# EAGLE design ESP32-Function (EAGLE 9.5.1)
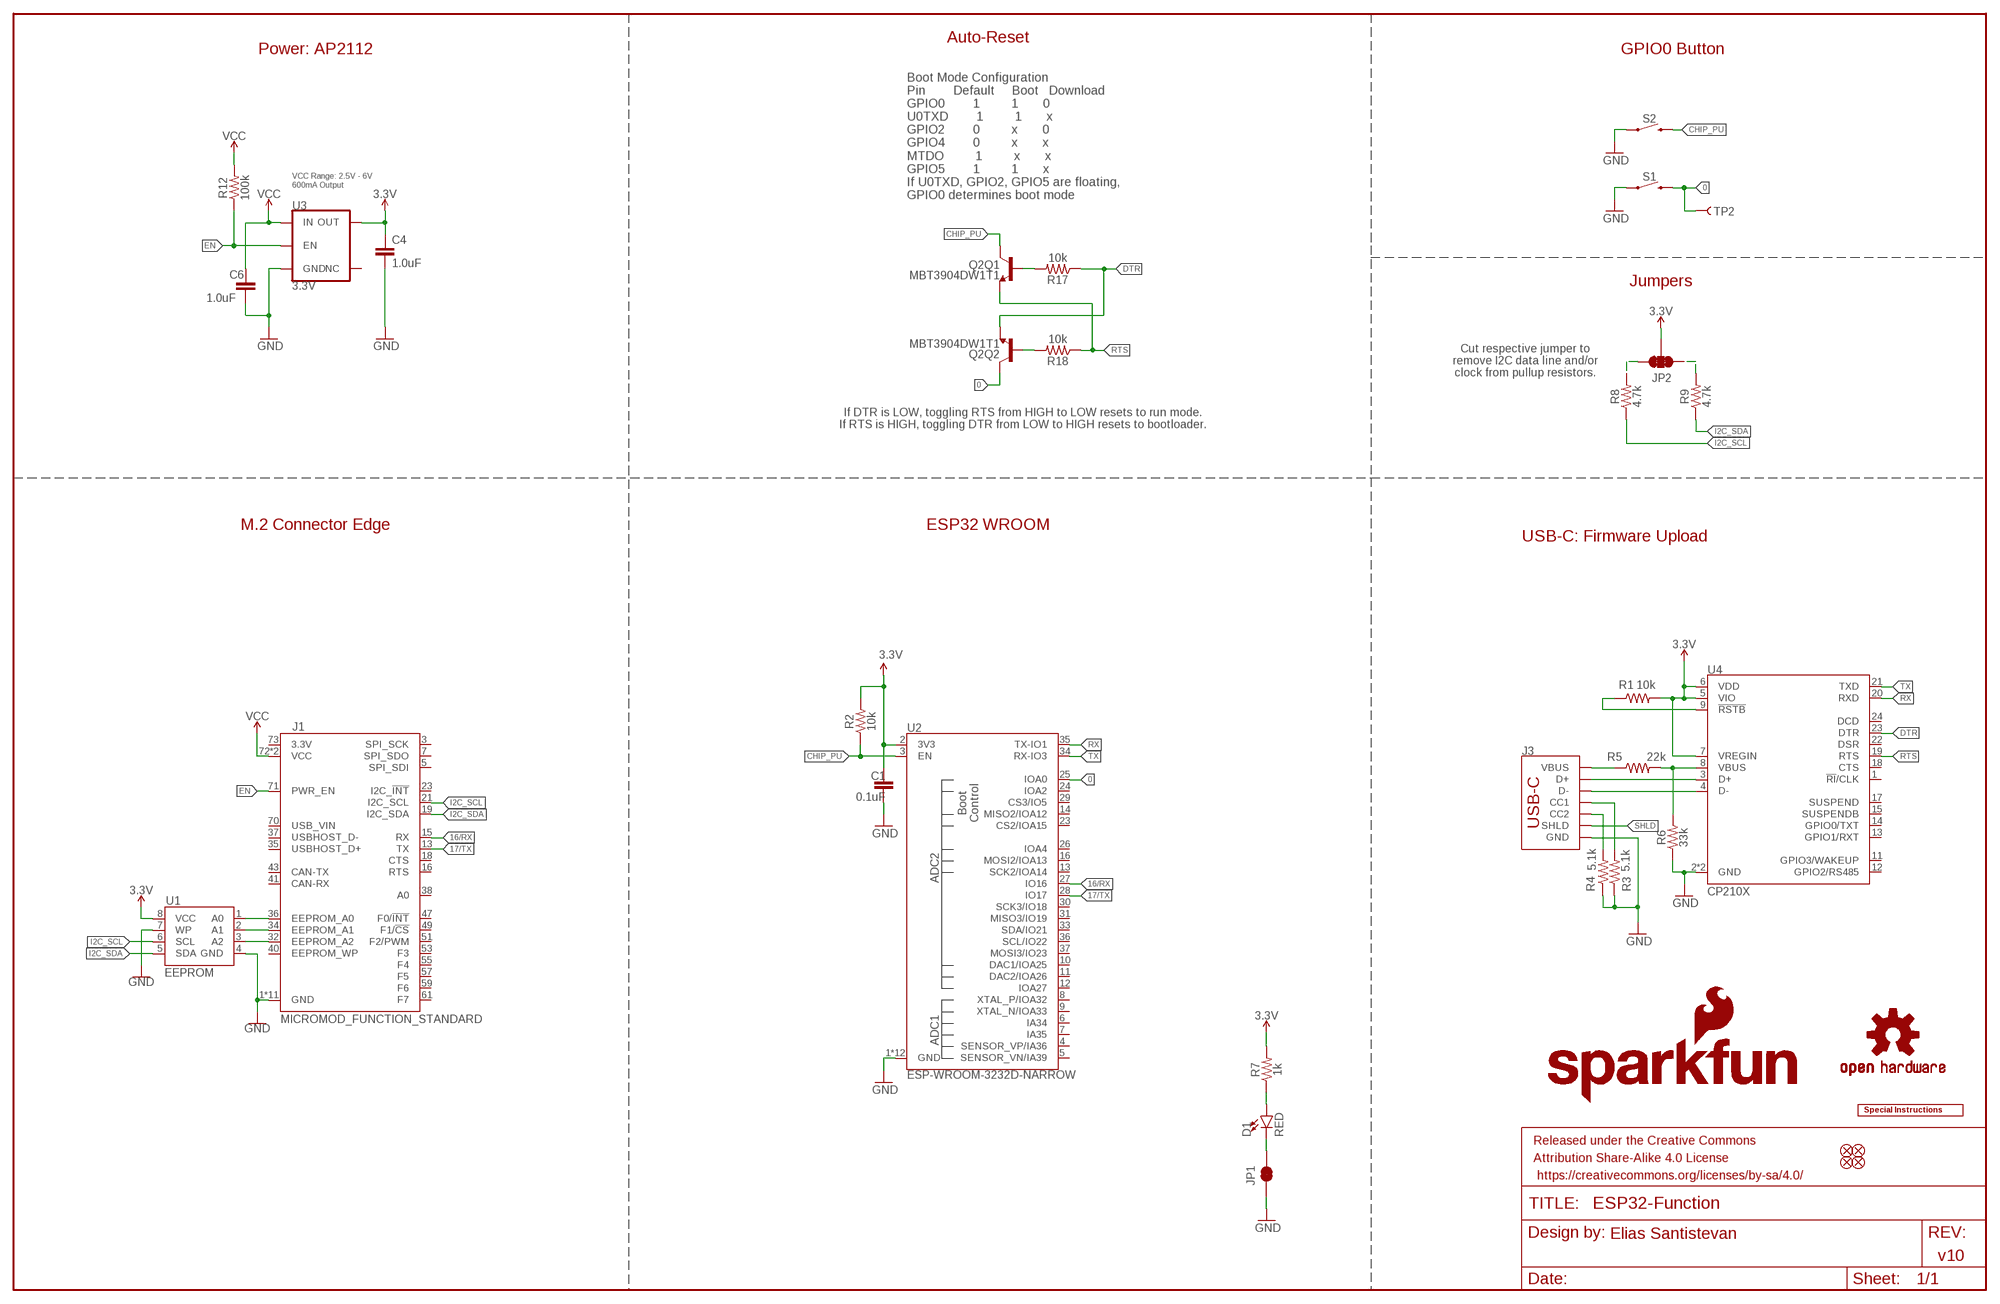
[diagram p0: schematic, sheet 1]

## Parts
C1  0.1uF  0.1UF-0603-25V-(+80/-20%)  [0603]
C4  1.0uF  1.0UF-0603-16V-10%  [0603]
C6  1.0uF  1.0UF-0603-16V-10%  [0603]
D1  RED  LED-RED0603  [LED-0603]
FD1  FIDUCIAL1X2  [FIDUCIAL-1X2]
FD2  FIDUCIAL1X2  [FIDUCIAL-1X2]
FD3  FIDUCIAL1X2  [FIDUCIAL-1X2]
FD4  FIDUCIAL1X2  [FIDUCIAL-1X2]
FRAME2  FRAME-LEDGER  [CREATIVE_COMMONS]
J1  MICROMOD_FUNCTION_STANDARD  [M.2-CARD-E-22_FUNCTION_STANDARD]
J3  USB_C_2-LAYER_PADS  [USB-C-16P-2LAYER-PADS]
JP1  JUMPER-SMT_2_NC_TRACE_SILK  [SMT-JUMPER_2_NC_TRACE_SILK]
JP2  JUMPER-SMT_3_2-NC_TRACE_SILK  [SMT-JUMPER_3_2-NC_TRACE_SILK]
LOGO1  SPECIAL_INSTRUCTIONS-ORDERING  [ORDERING_INSTRUCTIONS]
LOGO2  SFE_LOGO_NAME_FLAME.2_INCH  [SFE_LOGO_NAME_FLAME_.2]
LOGO3  OSHW-LOGOS  [OSHW-LOGO-S]
Q2  MBT3904DW1T1  TRANS_NPN_DUAL-MBT3904DW1T1  [SC70-6]
R1  10k  10KOHM-0603-1/10W-1%  [0603]
R2  10k  10KOHM-0603-1/10W-1%  [0603]
R3  5.1k  5.1KOHM5.1KOHM-0603-1/10W-1%  [0603]
R4  5.1k  5.1KOHM5.1KOHM-0603-1/10W-1%  [0603]
R5  22k  22KOHM-0603-1/10W-1%  [0603]
R6  33k  33KOHM-0603-1/10W-1%  [0603]
R7  1k  1KOHM-0603-1/10W-1%  [0603]
R8  4.7k  4.7KOHM-0603-1/10W-1%  [0603]
R9  4.7k  4.7KOHM-0603-1/10W-1%  [0603]
R12  100k  100KOHM-0603-1/10W-1%  [0603]
R17  10k  10KOHM-0603-1/10W-1%  [0603]
R18  10k  10KOHM-0603-1/10W-1%  [0603]
S1  MOMENTARY-SWITCH-SPST-SMD-5.2MM-TALL  [TACTILE_SWITCH_SMD_5.2MM]
S2  MOMENTARY-SWITCH-SPST-SMD-5.2MM-TALL  [TACTILE_SWITCH_SMD_5.2MM]
TP2  TEST-POINTTP_15TH_THRU  [TP_15TH]
U1  EEPROM  EEPROM-I2C512K  [SO08]
U2  ESP-WROOM-3232D-NARROW  [ESP-WROOM-32D-NARROW]
U3  3.3V  V_REG_AP2112K-3.3V  [SOT23-5]
U4  CP210X  CP2102N  [QFN24]

## Nets
0: Q2.6(Q2:C) S1.3 TP2.1 U2.25(IOA0)
3.3V: C1.1 C4.1 JP2.2 R1.2 R2.2 R7.2 U1.8(VCC) U2.2(3V3) U3.5(OUT) U4.5(VIO) U4.6(VDD) U4.7(VREGIN)
16/RX: J1.15(RX) U2.27(IO16)
17/TX: J1.13(TX) U2.28(IO17)
CHIP_PU: Q2.3(Q1:C) R2.1 S2.3 U2.3(EN)
D+: J3.A6(D+) J3.B6(D+) U4.3(D+)
D-: J3.A7(D-) J3.B7(D-) U4.4(D-)
DTR: Q2.1(Q2:E) R17.1 U4.23(DTR)
EN: J1.71(PWR_EN) R12.1 U3.3(EN)
GND: C1.2 C4.2 C6.2 J1.1(GND) J1.33(GND) J1.39(GND) J1.45(GND) J1.75(GND) J1.GND1(GND) J1.GND2(GND) J1.GND3(GND) J1.GND4(GND) J1.GND5(GND) J1.GND6(GND) J3.GND J3.GND2(GND) JP1.1 R3.1 R4.1 R6.1 S1.1 S2.1 U1.4(GND) U1.7(WP) U2.1(GND) U2.15(GND) U2.38(GND) U2.GND1(GND) U2.GNDT1(GND) U2.GNDT2(GND) U2.GNDT3(GND) U2.GNDT4(GND) U2.GNDT5(GND) U2.GNDT6(GND) U2.GNDT7(GND) U2.GNDT8(GND) U3.2(GND) U4.2(GND) U4.PAD(GND)
I2C_SCL: J1.21(I2C_SCL) R8.1 U1.6(SCL)
I2C_SDA: J1.19(I2C_SDA) R9.1 U1.5(SDA)
N$1: R1.1 U4.9(!RSTB)
N$2: J3.A5(CC1) R3.2
N$3: J3.VBUS1(VBUS) J3.VBUS2(VBUS) R5.1
N$4: R5.2 R6.2 U4.8(VBUS)
N$5: J3.B5(CC2) R4.2
N$6: D1.C JP1.2
N$7: D1.A R7.1
N$8: J1.32(EEPROM_A2) U1.3(A2)
N$9: J1.34(EEPROM_A1) U1.2(A1)
N$10: Q2.5(Q1:B) R17.2
N$11: J1.36(EEPROM_A0) U1.1(A0)
N$12: Q2.2(Q2:B) R18.2
N$13: JP2.1 R9.2
N$14: JP2.3 R8.2
RTS: Q2.4(Q1:E) R18.1 U4.19(RTS)
RX: U2.35(TX-IO1) U4.20(RXD)
SHLD: J3.SHLD1(SHLD) J3.SHLD2(SHLD) J3.SHLD3(SHLD) J3.SHLD4(SHLD)
TX: U2.34(RX-IO3) U4.21(TXD)
VCC: C6.1 J1.72(VCC) J1.74(VCC) R12.2 U3.1(IN)
Unconnected: J1.3(SPI_SCK) J1.5(SPI_SDI) J1.7(SPI_SDO) J1.16(RTS) J1.18(CTS) J1.23(I2C_!INT!) J1.35(USBHOST_D+) J1.37(USBHOST_D-) J1.38(A0) J1.40(EEPROM_WP) J1.41(CAN-RX) J1.43(CAN-TX) J1.47(F0/!INT!) J1.49(F1/!CS!) J1.51(F2/PWM) J1.53(F3) J1.55(F4) J1.57(F5) J1.59(F6) J1.61(F7) J1.70(USB_VIN) J1.73(3.3V) U2.4(SENSOR_VP/IA36) U2.5(SENSOR_VN/IA39) U2.6(IA34) U2.7(IA35) U2.8(XTAL_P/IOA32) U2.9(XTAL_N/IOA33) U2.10(DAC1/IOA25) U2.11(DAC2/IOA26) U2.12(IOA27) U2.13(SCK2/IOA14) U2.14(MISO2/IOA12) U2.16(MOSI2/IOA13) U2.23(CS2/IOA15) U2.24(IOA2) U2.26(IOA4) U2.29(CS3/IO5) U2.30(SCK3/IO18) U2.31(MISO3/IO19) U2.33(SDA/IO21) U2.36(SCL/IO22) U2.37(MOSI3/IO23) U3.4(NC) U4.1(!RI!/CLK) U4.11(GPIO3/WAKEUP) U4.12(GPIO2/RS485) U4.13(GPIO1/RXT) U4.14(GPIO0/TXT) U4.15(SUSPENDB) U4.17(SUSPEND) U4.18(CTS) U4.22(DSR) U4.24(DCD)

## Notes on the sheet
- Auto-Reset
- Power: AP2112 | GPIO0 Button
- VCC Range: 2.5V - 6V 
  600mA Output
- Boot Mode Configuration
  Pin        Default     Boot   Download
  GPIO0        1         1       0
  U0TXD        1         1       x
  GPIO2        0         x       0
  GPIO4        0         x       x
  MTDO         1         x       x
  GPIO5        1         1       x
  If U0TXD, GPIO2, GPIO5 are floating, 
  GPIO0 determines boot mode
- Jumpers
- Cut respective jumper to
  remove I2C data line and/or
  clock from pullup resistors.
- If DTR is LOW, toggling RTS from HIGH to LOW resets to run mode.
  If RTS is HIGH, toggling DTR from LOW to HIGH resets to bootloader.
- M.2 Connector Edge | ESP32 WROOM
- USB-C: Firmware Upload
- Elias Santistevan
- v10

## Library data of the parts
C1 = SparkFun-Capacitors:0.1UF: 0.1µF ceramic capacitors A capacitor is a passive two-terminal electrical component used to store electrical energy temporarily in an electric field.; PROD_ID: CAP-00810
C4 C6 = SparkFun-Capacitors:1.0UF: 1µF ceramic capacitors A capacitor is a passive two-terminal electrical component used to store electrical energy temporarily in an electric field.; PROD_ID: CAP-00868
D1 = SparkFun-LED:LED-RED: Red SMD LED Used in manufacturing of most products at SparkFun Packages: 0603 - SMD 0603 package [Product Link] <http://docs.avagotech.com/docs/AV02-0551EN> 0603 SMART - SMD 0603 SMART package ( more efficient and expensive)[Product Link] <http://www.osram-os.com/Graphics/XPic2/00077099_0.pdf> 1206 - SMD1206 package [Product Link] <https://www.sparkfun.com/datasheets/DevTools/LilyPad/Q150OVS4.pdff> SparkFun Products: Pro Mini 328 -5V <https://www.sparkfun.com/products/821> RedBoard <https://www.sparkfun.com/products/12757> IOIO-OTG <https://www.sparkfun.com/products/13613>; PROD_ID: DIO-00819
FD1-FD4 = SparkFun-Aesthetics:FIDUCIAL: Fiducial Alignment Points Point-of-reference for pick-and-place machines and other optical instruments.
FRAME2 = SparkFun-Aesthetics:FRAME-LEDGER: Schematic Frame - Ledger Standard 11x14 US Ledger frame
J1 = SparkFun-MicroMod:MICROMOD_FUNCTION: MicroMod Connector Description: A card edge connector and mating PCB connector to allow various MicroMod Processor Boards to be coupled with various carrier boards of different capabilities. Based on the M.2 standard.
J3 = SparkFun-Connectors:USB_C: USB Type C 16Pin Connector Super Speed pins not available on the 16-pin purely SMD connector so this part is best for USB 2.0 implementations. D1 and D2 are tied together enabling D+/- no matter which way the cable is plugged into the connector. The two channel configuration pins (CC1/2) are exposed. These are normally connected to ground via 5.1k resistors but can be reconfigured for high current/high power applications. **4-LAYER BOARD WARNING!!** If designing 4-layer board, make sure to select the variant _4-LAYER-ISOLATED. The linked footprint (USB-C-16-4LAYER-ISOLATED) includes some very necessary cutout polygons in the inner layers (2 and 15). This prevents the PTH mounting shield legs on the USB connector from electrically connecting any other polygons on the inner layers (usually VCC and GND).; PROD_ID: CONN-14122
JP1 = SparkFun-Jumpers:JUMPER-SMT_2_NC_TRACE: Normally closed trace jumper This jumper has a trace between two pads so it's normally closed (NC). Use a razor knife to open the connection. For best results follow the IPC guidelines for cutting traces: Cutout at least 0.063 mm (0.005 in). Remove all loose material to clean up the cut area. Seal the cut with an approved epoxy. Reapply solder to reclose the connection.
JP2 = SparkFun-Jumpers:JUMPER-SMT_3_2-NC_TRACE: Normally closed trace jumper (2 of 2 connections) This jumper has a trace between all three pads so they are normally closed (NC). Use a razor knife to open the connection(s). For best results follow the IPC guidelines for cutting traces: Cutout at least 0.063 mm (0.005 in). Remove all loose material to clean up the cut area. Seal the cut with an approved epoxy. Reapply solder to reclose the connection(s).
LOGO1 = SparkFun-Aesthetics:SPECIAL_INSTRUCTIONS: Special Ordering/Production Instructions Alert Symbol for special PCB ordering instructions or unique production process warnings. Ordering Instructions Production Instructions Types of information that should be added to box: Copper weight Soldermask color Silk color PCB thickness Number of layers PCB Standard: 1.6mm FR4 1 oz copper immersion silver plating red soldermask white silkscreen Types of information that should be added to box: Special wash requirements Depaneling instructions Humidification Glue curing Default text settings: 0.07 inch 9% ratio 50% line distance
LOGO2 = SparkFun-Aesthetics:SFE_LOGO_NAME_FLAME: SparkFun Font Logo w/ Flame This is the SparkFun full logo. The logo on the schematic will always be the same size; the package variant is the height of the flame part of the logo. Default layer for the logo on the board is tSilk.
LOGO3 = SparkFun-Aesthetics:OSHW-LOGO: Open-Source Hardware (OSHW) Logo This logo indicates the piece of hardware it is found on incorporates a OSHW license and/or adheres to the definition of open source hardware found here: http://freedomdefined.org/OSHW
Q2 = SparkFun-DiscreteSemi:TRANS_NPN_DUAL: Dual NPN Transistors in Single Package The MBT3904W1 puts two general purpose 3904 NPN transistors in a single package. Datasheet <http://www.onsemi.com/pub_link/Collateral/MBT3904DW1T1-D.PDF> SparkFun Products: SparkFun ESP32 Thing <https://www.sparkfun.com/products/13907>; PROD_ID: TRANS-13337
R1 R2 R17 R18 = SparkFun-Resistors:10KOHM: 10kΩ resistor A resistor is a passive two-terminal electrical component that implements electrical resistance as a circuit element. Resistors act to reduce current flow, and, at the same time, act to lower voltage levels within circuits. - Wikipedia; PROD_ID: RES-00824
R3 R4 = SparkFun-Resistors:5.1KOHM; PROD_ID: RES-12083
R5 = SparkFun-Resistors:22KOHM: 22kΩ resistor A resistor is a passive two-terminal electrical component that implements electrical resistance as a circuit element. Resistors act to reduce current flow, and, at the same time, act to lower voltage levels within circuits. - Wikipedia; PROD_ID: RES-07853
R6 = SparkFun-Resistors:33KOHM: 33kΩ resistor A resistor is a passive two-terminal electrical component that implements electrical resistance as a circuit element. Resistors act to reduce current flow, and, at the same time, act to lower voltage levels within circuits. - Wikipedia; PROD_ID: RES-08416
R7 = SparkFun-Resistors:1KOHM: 1kΩ resistor A resistor is a passive two-terminal electrical component that implements electrical resistance as a circuit element. Resistors act to reduce current flow, and, at the same time, act to lower voltage levels within circuits. - Wikipedia; PROD_ID: RES-07856
R8 R9 = SparkFun-Resistors:4.7KOHM: 4.7kΩ resistor A resistor is a passive two-terminal electrical component that implements electrical resistance as a circuit element. Resistors act to reduce current flow, and, at the same time, act to lower voltage levels within circuits. - Wikipedia; PROD_ID: RES-07857
R12 = SparkFun-Resistors:100KOHM: 100kΩ resistor A resistor is a passive two-terminal electrical component that implements electrical resistance as a circuit element. Resistors act to reduce current flow, and, at the same time, act to lower voltage levels within circuits. - Wikipedia; PROD_ID: RES-07828
S1 S2 = SparkFun-Switches:MOMENTARY-SWITCH-SPST: Momentary Switch (Pushbutton) - SPST Normally-open (NO) SPST momentary switches (buttons, pushbuttons). Variants PTH-12MM - 12mm square, through-hole Momentary Pushbutton Switch - 12mm Square <https://www.sparkfun.com/products/9190> (COM-09190) PTH-6.0MM, PTH-6.0MM-KIT - 6.0mm square, through-hole Mini Pushbutton Switch <https://www.sparkfun.com/products/97> (COM-00097) KIT package intended for soldering kit's - only one side of pads' copper is exposed. PTH-RIGHT-ANGLE-KIT - Right-angle, through-hole Right Angle Tactile Button <https://www.sparkfun.com/products/10791> - Used on SparkFun BigTime Watch Kit <https://www.sparkfun.com/products/11734> SMD-12MM - 12mm square, surface-mount Tactile Button - SMD (12mm) <https://www.sparkfun.com/products/12993> (COM-12993) Used on SparkFun PicoBoard <https://www.sparkfun.com/products/11888> SMD-4.5MM - 4.5mm Square Trackball Switch Used on SparkFun Blackberry Trackballer Breakout <https://www.sparkfun.com/products/13169> SMD-4.6MMX2.8MM - 4.60mm x 2.80mm, surface mount Used on SparkFun Pro Micro - RP2040 <https://www.sparkfun.com/products/17717> SMD-5.2MM, SMD-5.2-REDUNDANT - 5.2mm square, surface-mount Mini Pushbutton Switch - SMD <https://www.sparkfun.com/products/8720> (COM-08720) Used on Arduino Pro Mini <https://www.sparkfun.com/products/11114> REDUNDANT package connects both switch circuits together SMD-6.0X3.5MM - 6.0 x 3.5mm, surface mount Momentary Reset Switch SMD <https://www.sparkfun.com/products/8229> (COM-08229) SMD-6.2MM-TALL - 6.2mm square, surface mount Tactile Button - SMD (6mm) <https://www.sparkfun.com/products/12992> Used on SparkFun Digital Sandbox <https://www.sparkfun.com/products/12651> SMD-RIGHT-ANGLE - Right-angle, surface mount Used on SparkFun Block for Intel® Edison - Arduino <https://www.sparkfun.com/products/13036>; PROD_ID: SWCH-14139
TP2 = SparkFun-Connectors:TEST-POINT: SparkFun Test Points Bare copper test points for troubleshooting or In-Circuit-Testing. These are used by our Production team for verifying production board runs using pogo-pins on test beds. SparkFun Products: SparkFun LSM9DS1 Breakout <https://www.sparkfun.com/products/13284> SparkFun PSOC <https://www.sparkfun.com/products/13714> SparkFun Load Cell Amplifier <https://www.sparkfun.com/products/13879>
U1 = SparkFun-IC-Memory:EEPROM-I2C: I2C EEPROMs, 24LC256 and others 24LC256 Series 256 kb I2C 2 Wire (32 k x 8 Bit) 2.5 V Serial EEPROM SMD - SOIC-8 Datasheet SparkFun Products SparkFun UDB5 - PIC UAV Development Board <https://www.sparkfun.com/products/11703> (GPS-11703); PROD_ID: IC-14645
U2 = SparkFun-RF:ESP-WROOM-32: ESP-WROOM-32D - trace antenna (includes keepout) ESP-WROOM-32U - U.FL antenna connector Includes both "standard" footprints and "narrow" version (for use with tighter layouts).; PROD_ID: IC-15676
U3 = SparkFun-IC-Power:V_REG_AP2112: AP2112 - 600mA CMOS LDO Regulator w/ Enable The AP2112 is CMOS process low dropout linear regulator with enable function, the regulator delivers a guaranteed 600mA (min.) continuous load current. Features Output Voltage Accuracy: ±1.5% Output Current: 600mA (Min.) Foldback Short Current Protection: 50mA Enable Function to Turn ON/OFF VOUT Low Dropout Voltage (3.3V): 250mV (Typ.) @IOUT=600mA Excellent Load Regulation: 0.2%/A (Typ.) Excellent Line Regulation: 0.02%/V (Typ.) Low Quiescent Current: 55μA (Typ.) Low Standby Current: 0.01μA (Typ.) Low Output Noise: 50μVRMS PSRR: 100Hz -65dB, 1kHz -65dB OTSD Protection Stable with 1.0μF Flexible Cap: Ceramic, Tantalum and Aluminum Electrolytic Operation Temperature Range: -40°C to 85°C ESD: MM 400V, HBM 4000V; PROD_ID: VREG-12457
U4 = SparkFun-IC-Comms:CP2102N; PROD_ID: IC-14020

## Net classes
1 Antenna: width 1 mm, clearance 0.3 mm
2 3.3V: width 0.203 mm

## Board
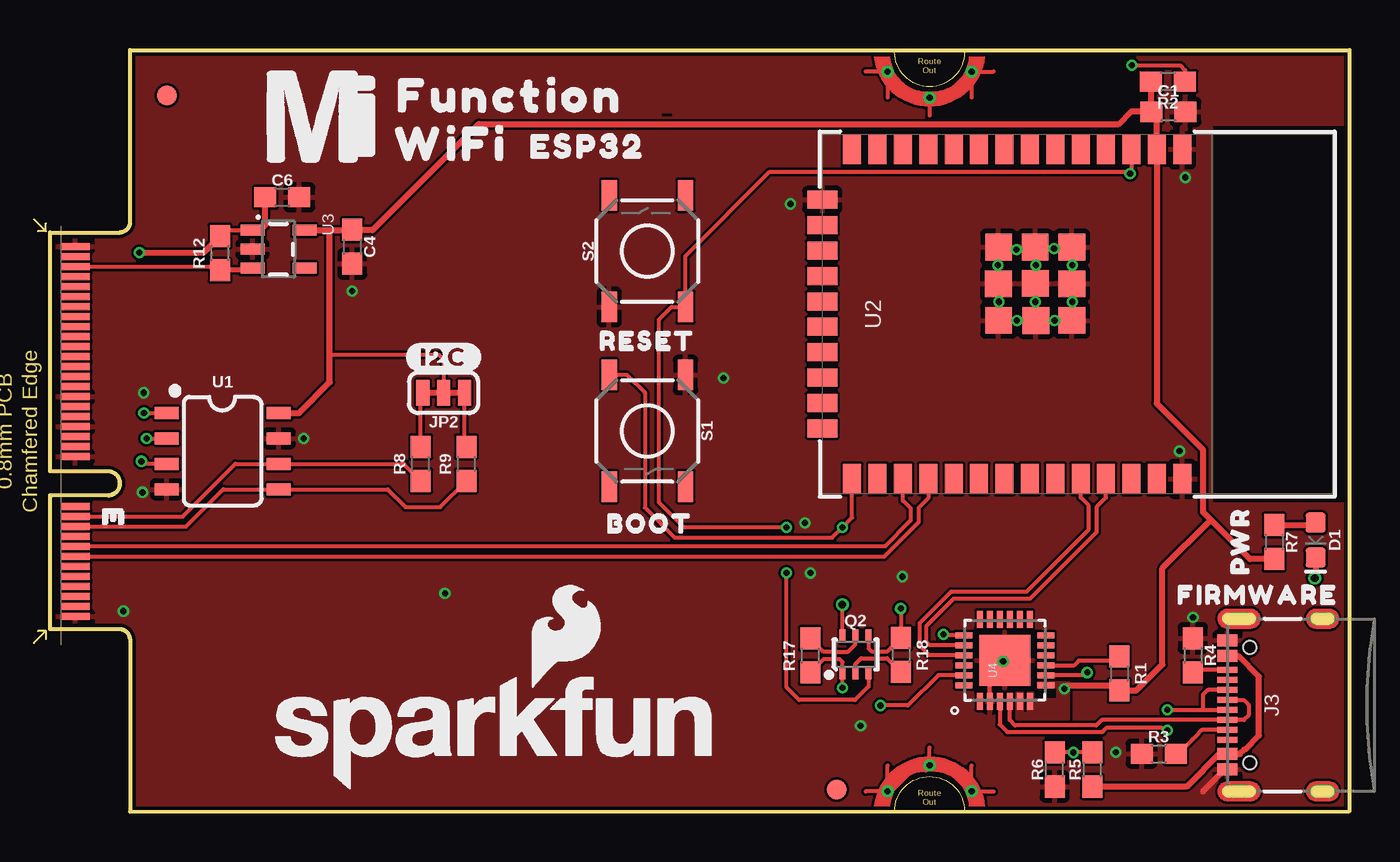
[diagram p1: board, top side]
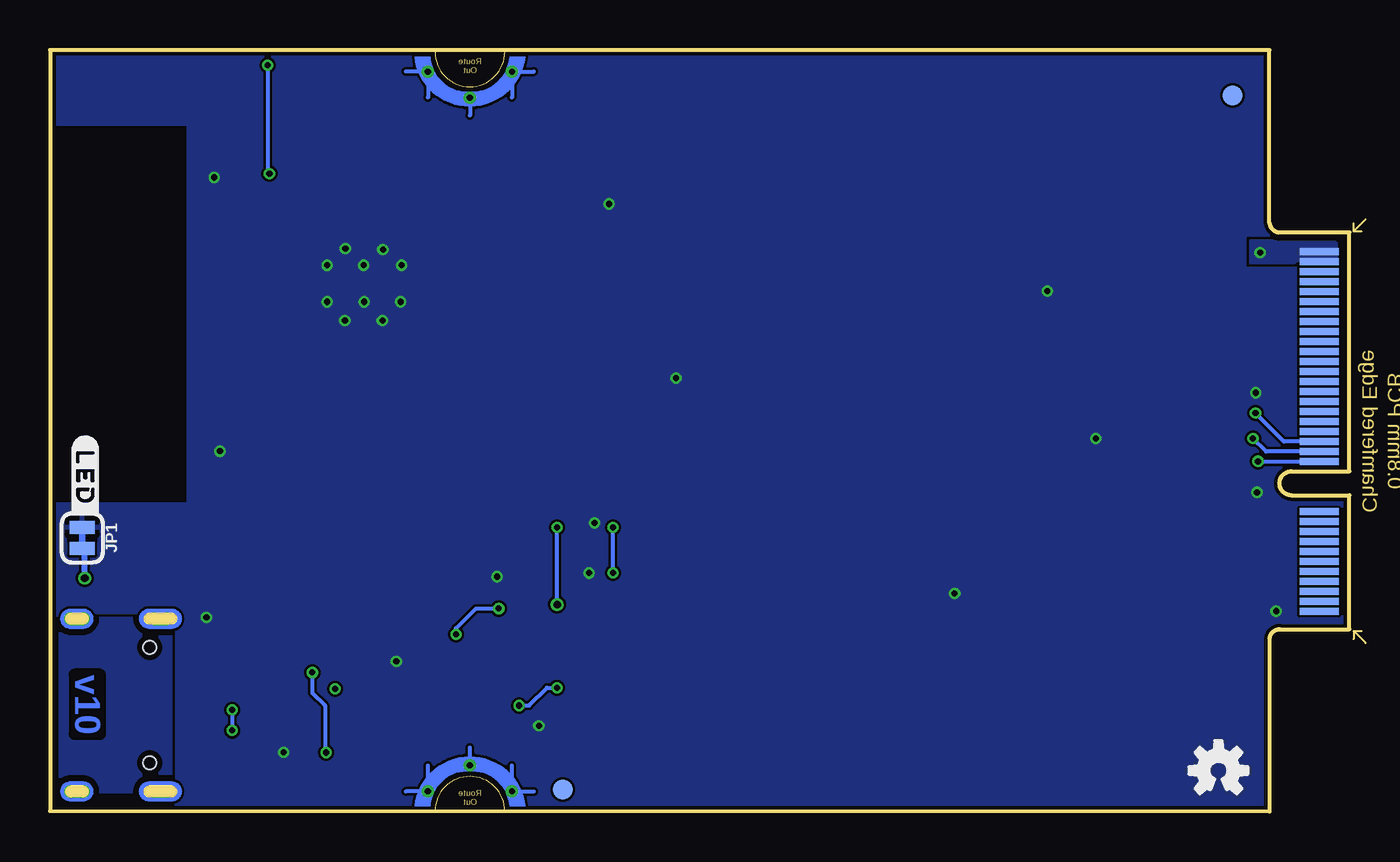
[diagram p2: board, bottom side, seen from below]

Size 64.99 x 38.1 mm. Coordinates in mm from the lower left corner, seen from the top.
Outline: 0,9.12 0,15.82 2.9,15.82 arc180 2.9,17.02 0,17.02 0,28.98 3.5,28.98 arc84 4,29.45 4,38.1 64.98,38.1 64.98,0.03 4,0 4,8.65 arc85 3.5,9.12 0,9.12
Copper layers (1*16): Top 0.035mm / dielectric 1.5mm / Bottom 0.035mm
Design rules "SparkFun-2-Layer-Minimum-JLCPCB": minimum track width 5mil, minimum drill 0.3mm, track to track 5mil, track to pad 5mil, pad to pad 5mil, via to via 5mil, smd to smd 5mil, copper to edge 7mil, drill to drill 7mil, minimum pad ring 5mil, minimum via ring 5mil, stop-mask expansion 2.5mil, vias tented up to drill 25mil, thermal gap 10mil
tRestrict: area 30.6,34.8 to 31.1,34.9; area 58.2,15.5 to 64.8,34.3
bRestrict: area 58.2,15.5 to 64.8,34.3

### Footprints (pad centres in the part's own frame; a part is rotated, then mirrored left to right if it is on the bottom)
0603 = smd 1.1 x 1: 1 -0.85,0; 2 0.85,0
LED-0603 = smd 1 x 1: A -0.877,0; C 0.877,0
FIDUCIAL-1X2 = smd 1 x 1: 1 0,0
M.2-CARD-E-22_FUNCTION_STANDARD = smd 0.35 x 1.45: 1 9.25,1.275; 3 8.75,1.275; 5 8.25,1.275; 7 7.75,1.275; 9 7.25,1.275; 11 6.75,1.275; 13 6.25,1.275; 15 5.75,1.275; 17 5.25,1.275; 19 4.75,1.275; 21 4.25,1.275; 23 3.75,1.275; 33 1.25,1.275; 35 0.75,1.275; 37 0.25,1.275; 39 -0.25,1.275; 41 -0.75,1.275; 43 -1.25,1.275; 45 -1.75,1.275; 47 -2.25,1.275; 49 -2.75,1.275; 51 -3.25,1.275; 53 -3.75,1.275; 55 -4.25,1.275; 57 -4.75,1.275; 59 -5.25,1.275; 61 -5.75,1.275; 63 -6.25,1.275; 65 -6.75,1.275; 67 -7.25,1.275; 69 -7.75,1.275; 71 -8.25,1.275; 73 -8.75,1.275; 75 -9.25,1.275 | smd 0.35 x 1.95 bottom: 2 9,1.525; 4 8.5,1.525; 6 8,1.525; 8 7.5,1.525; 10 7,1.525; 12 6.5,1.525; 14 6,1.525; 16 5.5,1.525; 18 5,1.525; 20 4.5,1.525; 22 4,1.525; 32 1.5,1.525; 34 1,1.525; 36 0.5,1.525; 38 0,1.525; 40 -0.5,1.525; 42 -1,1.525; 44 -1.5,1.525; 46 -2,1.525; 48 -2.5,1.525; 50 -3,1.525; 52 -3.5,1.525; 54 -4,1.525; 56 -4.5,1.525; 58 -5,1.525; 60 -5.5,1.525; 62 -6,1.525; 64 -6.5,1.525; 66 -7,1.525; 68 -7.5,1.525; 70 -8,1.525; 72 -8.5,1.525; 74 -9,1.525 | drill 0.305 pad 0.61: GND1 -18,41.9; GND2 -16.7,44; GND3 -18,46.1; GND4 18,41.9; GND5 16.7,44; GND6 18,46.1
USB-C-16P-2LAYER-PADS = smd 0.3 x 1: A5 -1.25,-0.34; A6 -0.25,-0.34; A7 0.25,-0.34; A8 1.25,-0.34; B5 1.75,-0.34; B6 0.75,-0.34; B7 -0.75,-0.34; B8 -1.75,-0.34 | smd 0.6 x 1: GND -3.225,-0.34; GND2 3.225,-0.34; VBUS1 -2.45,-0.34; VBUS2 2.45,-0.34 | drill 0.4 pad 0.6 long: SHLD1 -4.318,-0.915; SHLD2 4.318,-0.915; SHLD3 -4.318,-5.095; SHLD4 4.318,-5.095 | hole 0.65: -2.89,-1.445; 2.89,-1.445
SMT-JUMPER_2_NC_TRACE_SILK = smd 0.66 x 1.27: 1 -0.521,0; 2 0.521,0
SMT-JUMPER_3_2-NC_TRACE_SILK = smd 0.66 x 1.27: 1 -1.041,0; 2 0,0; 3 1.041,0
SC70-6 = smd 0.3 x 0.66: 1 -0.65,-0.92; 2 0,-0.92; 3 0.65,-0.92; 4 0.65,0.92; 5 0,0.92; 6 -0.65,0.92
TACTILE_SWITCH_SMD_5.2MM = smd 1.524 x 0.762: 1 -2.794,1.905; 2 2.794,1.905; 3 -2.794,-1.905; 4 2.794,-1.905
TP_15TH = drill 0.381 pad 0.61: 1 0,0
SO08 = smd 0.6 x 1.2: 1 -1.905,-2.8; 2 -0.635,-2.8; 3 0.635,-2.8; 4 1.905,-2.8; 5 1.905,2.8; 6 0.635,2.8; 7 -0.635,2.8; 8 -1.905,2.8
ESP-WROOM-32D-NARROW = smd 0.9 x 1.5: 1 6.43,8.238; 2 5.16,8.238; 3 3.89,8.238; 4 2.62,8.238; 5 1.35,8.238; 6 0.08,8.238; 7 -1.19,8.238; 8 -2.46,8.238; 9 -3.73,8.238; 10 -5,8.238; 11 -6.27,8.238; 12 -7.54,8.238; 13 -8.81,8.238; 14 -10.08,8.238; 25 -10.08,-8.238; 26 -8.81,-8.238; 27 -7.54,-8.238; 28 -6.27,-8.238; 29 -5,-8.238; 30 -3.73,-8.238; 31 -2.46,-8.238; 32 -1.19,-8.238; 33 0.08,-8.238; 34 1.35,-8.238; 35 2.62,-8.238; 36 3.89,-8.238; 37 5.16,-8.238; 38 6.43,-8.238 | smd 1.5 x 0.9: 15 -11.57,5.715; 16 -11.57,4.445; 17 -11.57,3.175; 18 -11.57,1.905; 19 -11.57,0.635; 20 -11.57,-0.635; 21 -11.57,-1.905; 22 -11.57,-3.175; 23 -11.57,-4.445; 24 -11.57,-5.715 | smd 1.33 x 1.33: GND1 -0.912,1.531; GNDT1 -2.751,3.346; GNDT2 -2.761,1.516; GNDT3 -2.751,-0.314; GNDT4 -0.891,-0.324; GNDT5 0.909,-0.314; GNDT6 0.909,1.516; GNDT7 0.909,3.346; GNDT8 -0.921,3.346
SOT23-5 = smd 0.55 x 1.2: 1 -0.95,-1.3; 2 0,-1.3; 3 0.95,-1.3; 4 0.95,1.3; 5 -0.95,1.3
QFN24 = smd 0.85 x 0.3: 1 -2.05,1.25; 2 -2.05,0.75; 3 -2.05,0.25; 4 -2.05,-0.25; 5 -2.05,-0.75; 6 -2.05,-1.25; 13 2.05,-1.25; 14 2.05,-0.75; 15 2.05,-0.25; 16 2.05,0.25; 17 2.05,0.75; 18 2.05,1.25 | smd 0.3 x 0.85: 7 -1.25,-2.05; 8 -0.75,-2.05; 9 -0.25,-2.05; 10 0.25,-2.05; 11 0.75,-2.05; 12 1.25,-2.05; 19 1.25,2.05; 20 0.75,2.05; 21 0.25,2.05; 22 -0.25,2.05; 23 -0.75,2.05; 24 -1.25,2.05 | smd 2.55 x 2.55: PAD 0,0

### Placement (x,y rotation side)
C1  55.93,35 0 top
C4  15.11,28.26 270 top
C6  11.62,30.73 0 top
D1  63.3,13.59 270 top
FD1  5.84,35.81 0 bottom
FD2  39.34,1.12 0 bottom
FD3  5.84,35.81 0 top
FD4  39.34,1.12 0 top
FRAME2  19.05,-11.43 0 top  (outside the outline)
J1  -0.01,19.02 270 top
J3  58.55,5.33 90 top
JP1  63.37,13.69 270 bottom
JP2  19.68,20.95 180 top
LOGO1  91.06,51.31 0 top  (outside the outline)
LOGO2  22.25,3.96 0 top
LOGO3  6.55,2.06 0 bottom
Q2  40.28,7.87 0 top
R1  53.47,6.91 270 top
R2  55.91,36.53 180 top
R3  55.45,2.9 0 top
R4  57.15,7.82 270 top
R5  52.12,2.11 90 top
R6  50.24,2.11 90 top
R7  61.21,13.49 270 top
R8  18.54,17.4 90 top
R9  20.83,17.4 90 top
R12  8.51,27.94 90 top
R17  38.02,7.81 90 top
R18  42.55,7.83 270 top
S1  29.87,19.05 270 top
S2  29.87,28.04 90 top
TP2  39.62,10.36 0 top
U1  8.64,18.03 270 top
U2  50.19,24.89 0 top
U3  11.43,28.13 270 top
U4  47.74,7.58 90 top
U$1  [BOOT3221]  30,14.4 0 top
U$2  [FUNCTION521]  22.99,35.81 0 top
U$3  [#I2C#1321540313558]  19.68,22.73 0 top
U$4  [ESP3212]  26.87,33.27 0 top
U$5  [RESET3220]  29.87,23.55 0 top
U$6  [MICROMOD_MI_LOGO_1]  13.59,34.8 0 top
U$7  [FIRMWARE3223]  60.38,10.85 0 top
U$8  [#LED#8]  63.22,16.69 270 bottom
U$9  [PWR3215]  59.51,13.54 90 top
U$10  [WIFI525]  20.07,33.4 0 top

### Tracks (layer width: path | path; a pad name or v marks a point on that pad's centre or on a via)
0  (via drill 0.3)
  Top 0.203: S1.3 28.85,21.84 29.74,20.95 29.74,15.21 31.24,13.72 39.12,13.72 v39.62,14.22 40.11,14.71 U2.25 | Q2.6 TP2.1
  Bottom 0.203: TP2.1 v39.62,14.22
3.3V  (via drill 0.3)
  Top 0.203: 13.99,22.86 19.43,22.86 19.68,22.61 JP2.2
  Top 0.305: U1.8 12.45,19.94 13.99,21.48 13.99,22.86 13.99,29.08 | v50.72,6.15 50.88,6.31 53.22,6.31 R1.2 54.32,6.06 55.63,7.37 55.63,12.19 58.04,14.61 | 58.04,14.61 57.66,14.99 57.66,18.11 55.35,20.42 U2.2 55.35,34.73 C1.1 55.05,35.03 | R7.2 60.01,12.64 58.04,14.61 | U3.5 13.99,29.08 | 13.99,29.08 15.09,29.08 C4.1 15.14,29.08 16.13,29.08 21.44,34.39 53.44,34.39 54.08,35.03 55.05,35.03 | R2.2 55.05,35.03
  pour Top (no thermals): 48.34,5.94 48.64,5.94 48.64,4.93 48.9,4.93 48.9,5.94 49.15,5.94 49.15,5.61 50.37,5.61 50.37,6.22 49.4,6.22 49.4,6.48 50.95,6.48 50.95,4.62 48.34,4.62
16/RX
  Top 0.203: U2.27 42.65,15.56 43.03,15.18 43.03,14.56 41.75,13.28 1.64,13.28 1.63,13.27 J1.15
17/TX
  Top 0.203: U2.28 43.92,15.69 43.43,15.2 43.43,14.48 41.72,12.77 J1.13
CHIP_PU  (via drill 0.3)
  Top 0.203: v36.83,11.94 36.83,6.22 37.47,5.59 40.26,5.59 40.93,6.26 Q2.3 | v36.83,14.22 31.7,14.22 30.45,15.47 30.45,24.61 31.09,25.25 S2.3 31.77,27.79 35.99,32 53.92,32 v54.01,31.91 54.08,31.98 U2.3 | R2.1 56.76,37.1 56.52,37.34 v54.1,37.34
  Bottom 0.203: v36.83,11.94 v36.83,14.22 | v54.1,37.34 54.1,32 v54.01,31.91
D+  (via drill 0.3)
  Top 0.203: U4.3 47.49,4.36 47.87,3.99 52.63,3.99 52.83,4.19 55.6,4.19 55.73,4.06 v55.88,4.06 | J3.A6 57.66,5.08 | J3.B6 57.9,6.08 57.66,5.84 57.66,5.08 | 57.66,5.08 v55.88,5.08 v55.88,5.09
  Bottom 0.203: v55.88,5.09 v55.88,4.06
D-
  Top 0.203: J3.A7 59.69,5.58 59.94,5.33 59.94,4.83 59.7,4.58 J3.B7 52.59,4.58 52.32,4.32 48.26,4.32 47.99,4.58 U4.4
DTR  (via drill 0.3)
  Top 0.203: U4.23 44.42,6.83 42.9,5.31 v41.53,5.31 | v39.62,6.2 39.63,6.21 Q2.1 39.63,7.48 39.5,7.62 38.69,7.62 R17.1
  Bottom 0.203: v41.53,5.31 41.02,5.31 40.13,6.2 v39.62,6.2
EN
  Top 0.203: 8.89,27.09 8.71,27.27 J1.71
  Top 0.254: U3.3 10.04,27.09 8.89,27.09 R12.1
GND  (via drill 0.3)
  Top 0.203: U4.2 46.99,6.6
  Top 0.305: J1.GND2 43.19,35.72 J1.GND1 | J3.GND 58.75,2.11 57.66,1.02 | J1.GND5 43.79,2.12 43.1,2.12 42,1.02 J1.GND4
  other vias: 15.11,26.04 19.75,10.92 3.67,10.03 4.62,15.98 47.4,27.33 48.34,28.12 50.22,28.17 49.3,27.33 51.13,27.33 51.13,25.5 49.28,25.5 47.45,25.5 48.36,24.56 50.24,24.56 4.69,20.95 57.16,9.73 53.3,2.97 42.63,11.76 37.76,14.45 38.04,11.94 33.68,21.69 37.03,30.4 56.77,31.72 56.49,18.03 47.66,7.52 40.54,4.29 12.69,18.67
  pour Top (rank 4): 0,29.21 0,0 64.77,0 64.77,38.1 0,38.1
  pour Bottom (rank 4): 0,38.1 64.77,38.1 64.77,0 0,0
I2C_SCL
  Top 0.203: J1.21 6.64,14.77 9.27,17.4 U1.6 17.69,17.4 R8.1
I2C_SDA
  Top 0.203: J1.19 6.8,14.27 8.67,16.13 U1.5 16.89,16.13 17.78,15.24 19.52,15.24 R9.1
N$1
  Top 0.203: U4.9 51.22,7.33 51.45,7.55 53.26,7.55 R1.1
N$2
  Top 0.203: J3.A5 57.61,4.08 57.24,3.72 57.15,3.62 56.42,2.9 R3.2
N$3
  Top 0.305: J3.VBUS2 59.42,7.78 60.45,6.76 60.45,3.81 59.74,3.1 59.72,3.1 59.51,2.88 J3.VBUS1 58.83,2.94 58.52,2.94 56.84,1.26 R5.1
N$4  (via drill 0.3)
  Top 0.203: R5.2 v51.18,2.96 R6.2 | v51.87,6.96 51.73,6.83 U4.8
  Bottom 0.203: v51.87,6.96 51.87,5.94 51.23,5.31 51.23,3.01 v51.18,2.96
N$5
  Top 0.203: J3.B5 57.26,7.08 R4.2
N$6  (via drill 0.38)
  Top 0.305: D1.C 63.3,11.73 v63.25,11.68
  Bottom 0.305: v63.25,11.68 63.25,13.04 JP1.2
N$7
  Top 0.305: R7.1 63.17,14.34 D1.A
N$8  (via drill 0.3)
  Top 0.203: U1.3 4.7,17.4 v4.57,17.53
  Bottom 0.203: v4.57,17.53 1.52,17.53 J1.32
N$9  (via drill 0.3)
  Top 0.203: v4.83,18.67 U1.2
  Bottom 0.203: J1.34 4.17,18.02 v4.83,18.67
N$10
  Top 0.203: Q2.5 40.27,8.77 40.27,8.37 39.9,8 39.37,8 39.29,8 38.68,8 R17.2
N$11  (via drill 0.3)
  Top 0.203: v4.7,19.94 U1.1
  Bottom 0.203: J1.36 3.28,18.52 v4.7,19.94
N$12
  Top 0.203: Q2.2 40.28,7.39 40.56,7.67 41.86,7.67 R18.2
N$13
  Top 0.203: R9.2 20.73,18.35 JP2.1
N$14
  Top 0.203: R8.2 18.54,20.85 JP2.3
RTS  (via drill 0.3)
  Top 0.203: Q2.4 40.93,8.16 41.07,8.03 41.89,8.03 R18.1 v42.55,10.16 | U4.19 44.72,8.83 v44.68,8.87
  Bottom 0.203: v42.55,10.16 43.69,10.16 44.68,9.17 v44.68,8.87
RX
  Top 0.203: U4.20 44,8.33 43.81,8.51 43.81,9.27 45.21,10.67 49.02,10.67 52.33,13.97 52.33,15.23 52.81,15.71 U2.35
SHLD
  pour Top (isolate 0.305, no thermals): 58.98,9.65 64.77,9.65 64.77,0.99 58.98,0.99
  pour Bottom (isolate 0.305, no thermals): 58.95,9.65 64.77,9.65 64.77,1.02 58.95,1.02
TX
  Top 0.203: U4.21 43.99,7.83 43.48,8.33 43.48,9.42 45.06,11 48.82,11 51.94,14.12 51.94,15.31 51.54,15.71 U2.34
VCC  (via drill 0.3)
  Top 0.203: R12.2 8.8,29.08 U3.1
  Top 0.305: v4.47,27.96 7.68,27.96 R12.2 | U3.1 10.51,29.08 10.77,29.34 C6.1
  pour Bottom (isolate 0.305, no thermals): 0.64,28.45 0.64,27.43 4.95,27.43 4.95,28.57 0.76,28.57

### Text on the board
Bottom: v10
Measures: Units in Inches
tDocu: 0.8mm PCB Thickness | ENIG Finish | Chamfered Edge | Elias Santistevan